# Altium schematic sheet Power circuit.SchDoc
size A
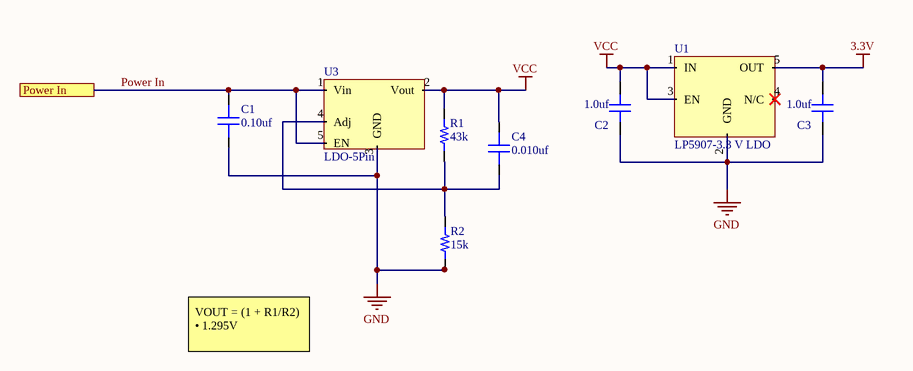
[diagram p0: Power circuit.SchDoc]

## Parts
C1  value 0.10uf  [CAP 0603/1608]  (hidden comment: Capacitor MLCC 0.10uf 16V CAP 0603/1608)
C2  value 1.0uf  [CAP 0603/1608]  (hidden comment: Capacitor MLCC 1.0uf 16V CAP 0603/1608)
C3  value 1.0uf  [CAP 0603/1608]  (hidden comment: Capacitor MLCC 1.0uf 16V CAP 0603/1608)
C4  value 0.010uf  [CAP 0603/1608]  (hidden comment: Capacitor MLCC 0.010uf 16V CAP 0603/1608)
R1  value 43k  [RES 0603/1608]  (hidden comment: Resistor 43k 0603 1/10W 1%)
R2  value 15k  [RES 0603/1608]  (hidden comment: Resistor 15k 0603 1/10W 1%)
U1  LP5907-3.3 V LDO  [SOT23-5]
U3  LDO-5Pin  [SOT223-5]

## Ports
Power In

## Nets
3.3V: C3.2 U1.5(OUT)
GND: C1.1 C2.1 C3.1 R2.1 U1.2(GND) U3.3(GND)
VCC: C2.2 C4.2 R1.2 U1.1(IN) U1.3(EN) U3.2(Vout)
Power In: C1.2 U3.1(Vin) U3.5(EN) ; port Power In
NetC4_1: C4.1 R1.1 R2.2 U3.4(Adj)

Not connected (* = marked no-connect by the designer): U1 4(N/C)*

## Notes on the sheet
- VOUT = (1 + R1/R2) • 1.295V

## Library data of the parts
C1 = 223: Manufacturer_id: 1; idCapacitor: 223; Name: Cap_0.10uf_16V_CAP 0603/1608; Dielectric: Ceramic; Created_By: Nick Mah; Drawer_id: 1; Voltage_Rating: 16V; Package: CAP 0603/1608; Created_Date: 10/20/2018
C2 C3 = 229: Manufacturer_id: 1; idCapacitor: 229; Name: Cap_1.0uf_16V_CAP 0603/1608; Dielectric: Ceramic; Created_By: Nick Mah; Drawer_id: 1; Voltage_Rating: 16V; Package: CAP 0603/1608; Created_Date: 10/20/2018
C4 = 217: Manufacturer_id: 1; idCapacitor: 217; Name: Cap_0.010uf_16V_CAP 0603/1608; Dielectric: Ceramic; Created_By: Nick Mah; Drawer_id: 1; Voltage_Rating: 16V; Package: CAP 0603/1608; Created_Date: 10/20/2018
R1 = 328: Manufacturer_id: 1; idResistor: 328; Name: Res_43k_0603_1/10W_1%; Created_By: Nick Mah; Supplier 1: Digi-Key; Drawer_id: 1; Tolerance: 1%; Power: 1/10W; Package: 0603; ComponentLink1Description: Datasheet; Created_Date: 2018-10-20
R2 = 317: Manufacturer_id: 1; idResistor: 317; Name: Res_15k_0603_1/10W_1%; Created_By: Nick Mah; Supplier 1: Digi-Key; Drawer_id: 1; Tolerance: 1%; Power: 1/10W; Package: 0603; ComponentLink1Description: Datasheet; Created_Date: 2018-10-20
U1 = 4: Manufacturer_id: 1; MfrPartNo: LP5907MFX-3.3/NOPB; idPMIC_Lin: 4; Name: LP5907 LDO; Value: 3.3 V; Vin(Max): 6V; Vout(Min): 3.3V; Drawer_id: 1; Package: SOT23-5; Link: https://www.digikey.com/product-detail/en/texas-instruments/LP5907MFX-3.3-NOPB/296-38557-2-ND/3906441
U3 = 7: Manufacturer_id: 1; MfrPartNo: REG104GA-A; idPMIC_Lin: 7; Name: 5V 1A LDO; Value: 5.5V 1A; Vin(Min): -.3V; Vin(Max): 16V; Vout(Min): 2.5V; Vout(Max): 5V; Current_Rating: 1A; Drawer_id: 1; Num_Outputs: 1; Package: SOT-223-6; Link: https://www.digikey.com/product-detail/en/texas-instruments/REG104GA-A/REG104GA-A-ND/380288?utm_adgroup=Integrated%20Circuits&slid=&gclid=CjwKCAjwpKveBRAwEiwAo4Pqm3P1cbCGhU8VzQ4hsaig_pQLQzWQ1vPK7ianKpgKPxk_g8_0T-ULMBoCGh8QAvD_BwE